# Altium schematic sheet UART.SchDoc
size A4; SheetNumber: 8; SheetTotal: 8
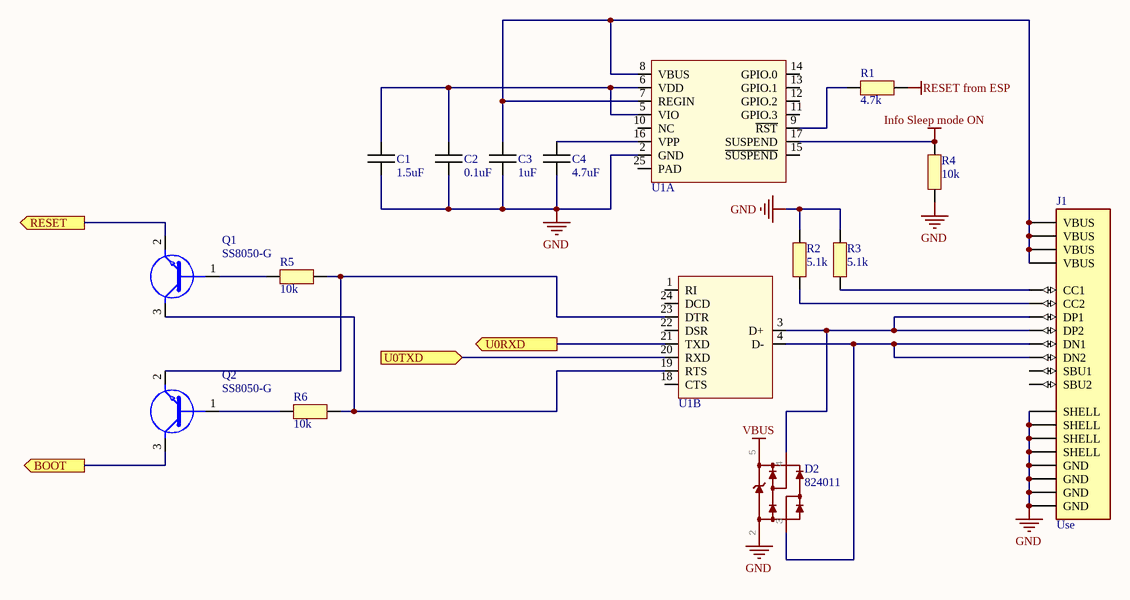
[diagram p0: UART.SchDoc]

## Parts
C1  1.5uF  [CAPC1005X06N]
C2  0.1uF  [CAPC1005X06N]
C3  1uF  [CAPC1005X06N]
C4  4.7uF  [CAPC1005X06N]
D2  824011  [824011]
J1  Use  [USB4085-GF-A]
Q1  SS8050-G  [SS8050-G]
Q2  SS8050-G  [SS8050-G]
R1  4.7k  [RESC1005X06N]
R2  5.1k  [RESC1005X06N]
R3  5.1k  [RESC1005X06N]
R4  10k  [RESC1005X06N]
R5  10k  [RESC1005X06N]
R6  10k  [RESC1005X06N]
U1  CP2104-F03-GM  [PQFN50P400X400X80_HS-25N]  (value not drawn)  (parts A,B of 2)

## Ports
BOOT (out), RESET (out), U0RXD (out), U0TXD (in)

## Nets
GND: C1.2 C2.2 C3.2 C4.2 D2.2(GND) J1.A1(GND) J1.A12(GND) J1.B1(GND) J1.B12(GND) J1.S1(SHELL) J1.S2(SHELL) J1.S3(SHELL) J1.S4(SHELL) R2.2 R3.2 R4.2 U1.2(GND)
Info Sleep mode ON: R4.1 U1.17(SUSPEND)
RESET from ESP: R1.1
VBUS: D2.5(VDD)
BOOT: Q2.3(C) ; port BOOT
RESET: Q1.2(E) ; port RESET
U0RXD: U1.21(TXD) ; port U0RXD
U0TXD: U1.20(RXD) ; port U0TXD
NetC1_1: C1.1 C2.1 U1.5(VIO) U1.6(VDD)
NetC3_1: C3.1 J1.A4(VBUS) J1.A9(VBUS) J1.B4(VBUS) J1.B9(VBUS) U1.7(REGIN) U1.8(VBUS)
NetC4_1: C4.1 U1.16(VPP)
NetD2_3: D2.3 J1.A7(DN1) J1.B7(DN2) U1.4(D-)
NetD2_4: D2.4 J1.A6(DP1) J1.B6(DP2) U1.3(D+)
NetJ1_A5: J1.A5(CC1) R3.1
NetJ1_B5: J1.B5(CC2) R2.1
NetQ1_1: Q1.1(B) R5.2
NetQ1_3: Q1.3(C) R6.1 U1.19(RTS)
NetQ2_1: Q2.1(B) R6.2
NetQ2_2: Q2.2(E) R5.1 U1.23(DTR)
NetR1_2: R1.2 U1.9(~{RST})

Not connected (* = marked no-connect by the designer): J1 A8(SBU1) B8(SBU2); U1 1(RI) 10(NC) 11(GPIO.3) 12(GPIO.2) 13(GPIO.1) 14(GPIO.0) 15(~{SUSPEND}) 18(CTS) 22(DSR) 24(DCD) 25(PAD)

## Library data of the parts
C1-C4 = Capacitor
D2 = 824011: TVS Diode Array WE-TVS, High Speed Series  - Low capazity - No leakage current - Low clamping voltage - high ESD voltage protection  -- USB 1.0 - 2.0
J1 = USB4085-GF-A: Connecteurs USB USB Type C, 2.0, Rec, TH , G/F, RA , Top Mnt, T & R
Q1 Q2 = SS8050-G: Bipolar Transistors - BJT NPN TRANSISTOR 1.5A 40V
R1-R6 = Resistor
U1 = USBBridge: USB Bridge, USB to UART USB 2.0 UART Interface 24-QFN (4x4); Manufacturer 1: Silicon Labs; Supplier 1: Arrow Electronics; Supplier Part Number 1: CP2104-F03-GM; Manufacturer Part Number 1: CP2104-F03-GM